# EAGLE schematic Diversity (EAGLE 6.5.0)
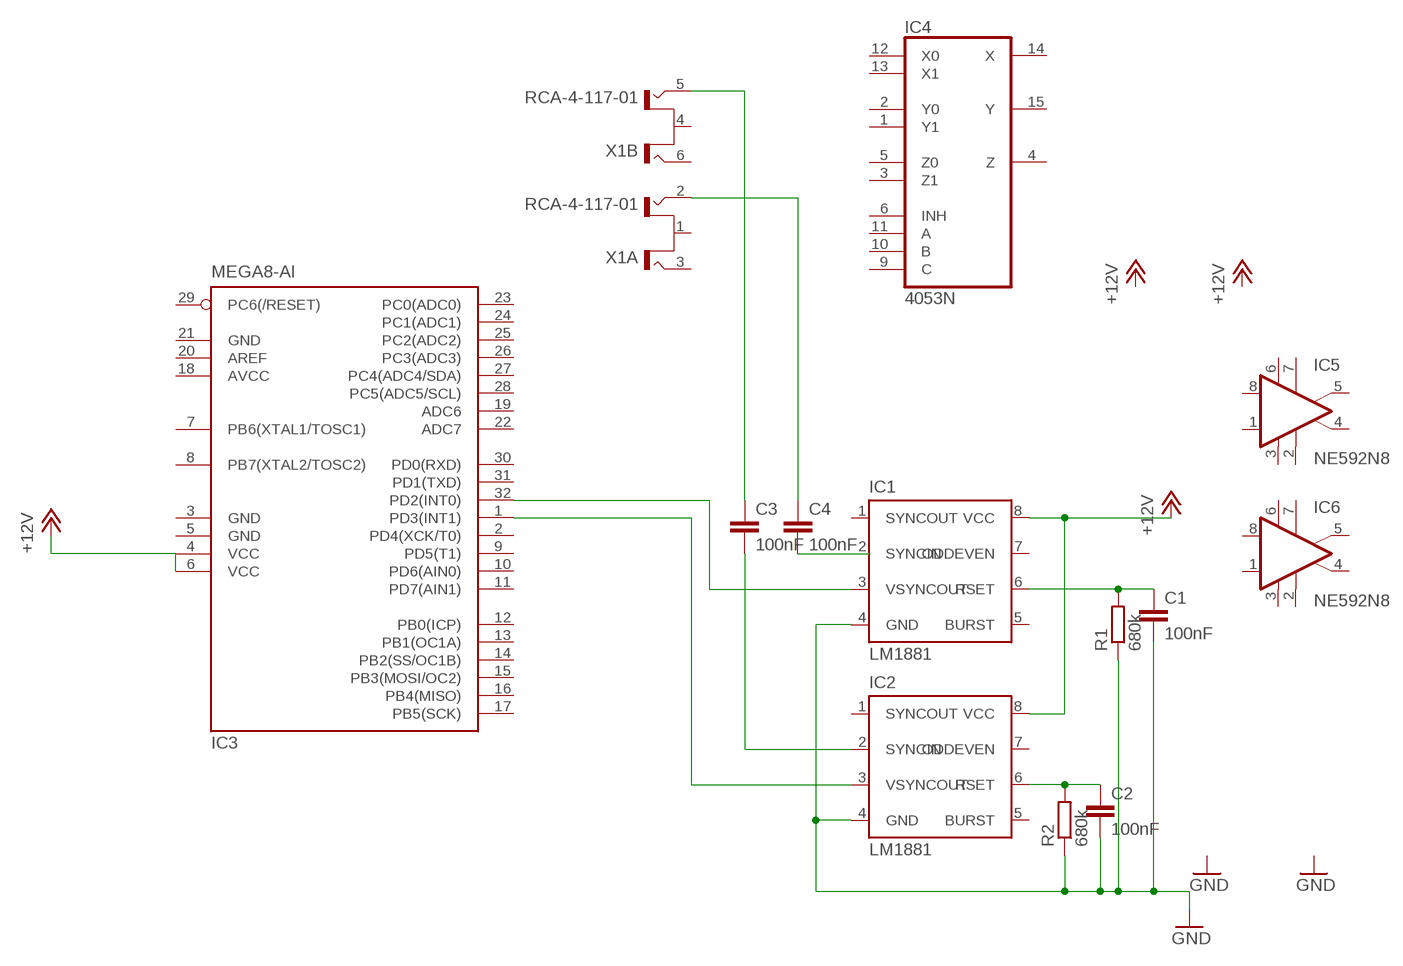
[diagram p0: schematic, sheet 1]

## Parts
C1  100nF  C2.5/2  [C2.5-2]
C2  100nF  C2.5/2  [C2.5-2]
C3  100nF  C2.5/2  [C2.5-2]
C4  100nF  C2.5/2  [C2.5-2]
IC1  LM1881  [DIL08]
IC2  LM1881  [DIL08]
IC3  MEGA8-AI  [TQFP32-08]
IC4  4053N  [DIL16]
IC5  NE592N8  [DIL08]
IC6  NE592N8  [DIL08]
R1  680k  R-EU_0207/7  [0207/7]
R2  680k  R-EU_0207/7  [0207/7]
X1  RCA-4-117-01  [RCA-4-117-01]

## Nets
+12V: IC1.8(VCC) IC2.8(VCC) IC3.4(VCC) IC3.6(VCC)
GND: C1.2 C2.2 IC1.4(GND) IC2.4(GND) R1.1 R2.1
N$1: IC1.3(VSYNCOUT) IC3.32(PD2(INT0))
N$2: IC2.3(VSYNCOUT) IC3.1(PD3(INT1))
N$3: C4.1 X1.2(A:T1)
N$4: C4.2
N$5: C3.2 IC2.2(SYNCIN)
N$7: C3.1 X1.5(B:T1)
N$9: C2.1 IC2.6(RSET) R2.2
N$10: C1.1 IC1.6(RSET) R1.2
Unconnected: IC1.1(SYNCOUT) IC1.2(SYNCIN) IC1.5(BURST) IC1.7(ODDEVEN) IC2.1(SYNCOUT) IC2.5(BURST) IC2.7(ODDEVEN) IC3.2(PD4(XCK/T0)) IC3.7(PB6(XTAL1/TOSC1)) IC3.8(PB7(XTAL2/TOSC2)) IC3.9(PD5(T1)) IC3.10(PD6(AIN0)) IC3.11(PD7(AIN1)) IC3.12(PB0(ICP)) IC3.13(PB1(OC1A)) IC3.14(PB2(SS/OC1B)) IC3.15(PB3(MOSI/OC2)) IC3.16(PB4(MISO)) IC3.17(PB5(SCK)) IC3.19(ADC6) IC3.20(AREF) IC3.22(ADC7) IC3.23(PC0(ADC0)) IC3.24(PC1(ADC1)) IC3.25(PC2(ADC2)) IC3.26(PC3(ADC3)) IC3.27(PC4(ADC4/SDA)) IC3.28(PC5(ADC5/SCL)) IC3.29(PC6(/RESET)) IC3.30(PD0(RXD)) IC3.31(PD1(TXD)) IC4.1(Y1) IC4.2(Y0) IC4.3(Z1) IC4.4(Z) IC4.5(Z0) IC4.6(INH) IC4.9(C) IC4.10(B) IC4.11(A) IC4.12(X0) IC4.13(X1) IC4.14(X) IC4.15(Y) IC5.1(IN2) IC5.2(G1B) IC5.4(OUT2) IC5.5(OUT1) IC5.7(G1A) IC5.8(IN1) IC6.1(IN2) IC6.2(G1B) IC6.4(OUT2) IC6.5(OUT1) IC6.7(G1A) IC6.8(IN1) X1.1(A:S) X1.3(A:T2) X1.4(B:S) X1.6(B:T2)

## Power pins joined to a net without a drawn wire
AVCC: IC3.18(AVCC)
GND: IC3.3(GND) IC3.5(GND) IC3.21(GND) IC4.8(GND)
V+: IC5.6(V+) IC6.6(V+)
V-: IC5.3(V-) IC6.3(V-)
VCC: IC4.16(VCC)
VEE: IC4.7(VEE)

## Library data of the parts
C1-C4 = capacitor-wima:C: CAPACITOR naming: grid - package width
IC1 IC2 = lm1881:LM1881
IC3 = atmel:MEGA8: MICROCONTROLLER 8 Kbytes FLASH, 1 kbytes SRAM, 512 bytes EEPROM, USART, 6-channel 10 bit ADC, 2-channel 8 bit ADC Pin compatible with Atmega48, ATMega88, ATMega168 Source: avr.lbr; MPN: ATMEGA8-16AU; OC_FARNELL: 9171371; OC_NEWARK: 73M8863
IC4 = 40xx:4053: Triple 2-channel ANALOG MULTIPLEXER
IC5 IC6 = linear:NE592?8: VIDEO AMPLIFIER
R1 R2 = resistor:R-EU_: RESISTOR, European symbol
X1 = con-conrad:RCA-4-117-01: Cinch-Anschlussplatte 72385 Gold, Rot, Weiß BKL Electronic Conrad Bestellnummer : 736910 - 62 Source: Data sheet <http://www.produktinfo.conrad.com/datenblaetter/725000-749999/736910-da-01-en-Cinch_Anschlussplatte_4polig.pdf>